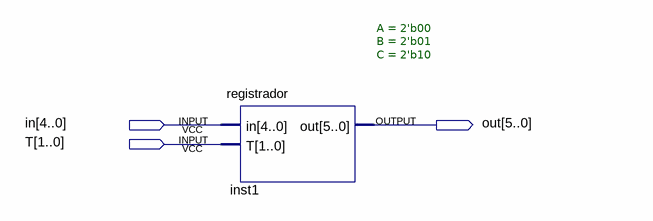
[diagram p0: schematic sheet]
// Quartus schematic testeregistradorx.bdf as structural Verilog: 1 symbols, 3 pins
module testeregistradorx (
  input  [4:0] in,
  input  [1:0] T,
  output [5:0] out
);

  registrador #(.A(2'b00), .B(2'b01), .C(2'b10)) inst1 (.in(in), .T(T), .out(out));
endmodule
